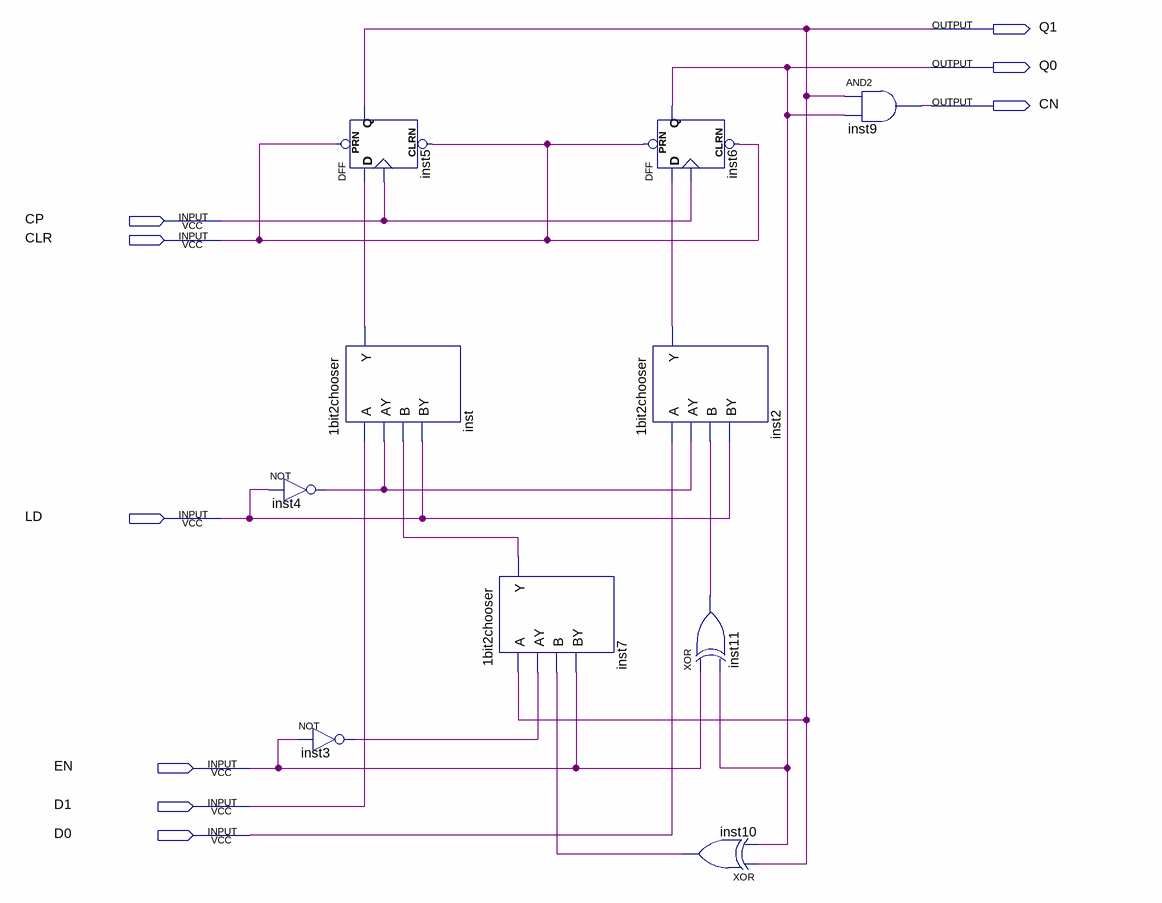
[diagram p0: schematic sheet]
// Quartus schematic 2plus1.bdf as structural Verilog: 10 symbols, 9 pins
module \2plus1  (
  input  CP,
  input  CLR,
  input  LD,
  input  EN,
  input  D1,
  input  D0,
  output Q1,
  output Q0,
  output CN
);

  wire inst2_y, inst3_out, inst4_out, inst7_y, inst10_out, inst11_out, inst_y;

  \1bit2chooser  inst (.A(D1), .AY(inst4_out), .B(inst7_y), .BY(LD), .Y(inst_y));
  not inst4 (inst4_out, LD);
  not inst3 (inst3_out, EN);
  DFF inst5 (.CLRN(CLR), .CLK(CP), .D(inst_y), .PRN(CLR), .Q(Q1));
  \1bit2chooser  inst7 (.A(Q1), .AY(inst3_out), .B(inst10_out), .BY(EN), .Y(inst7_y));
  \1bit2chooser  inst2 (.A(D0), .AY(inst4_out), .B(inst11_out), .BY(LD), .Y(inst2_y));
  DFF inst6 (.CLRN(CLR), .CLK(CP), .D(inst2_y), .PRN(CLR), .Q(Q0));
  xor inst11 (inst11_out, EN, Q0);
  xor inst10 (inst10_out, Q1, Q0);
  and inst9 (CN, Q1, Q0);
endmodule
